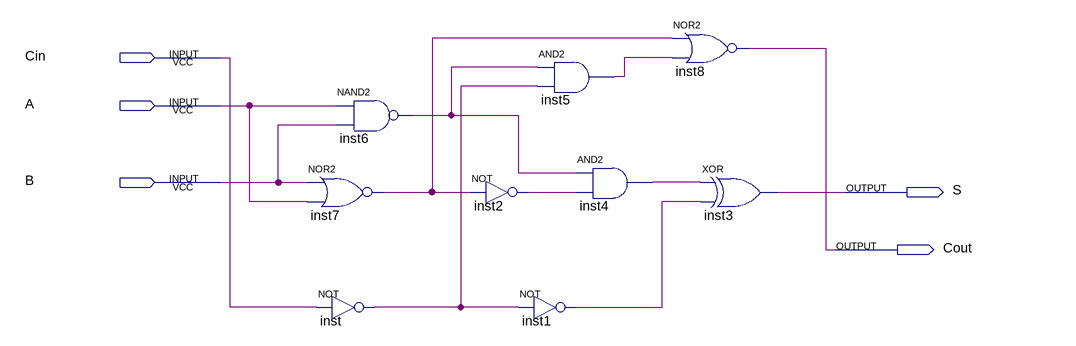
[diagram p0: schematic sheet]
// Quartus schematic soma1bit.bdf as structural Verilog: 9 symbols, 5 pins
module soma1bit (
  input  Cin,
  input  A,
  input  B,
  output S,
  output Cout
);

  wire inst1_out, inst2_out, inst4_out, inst5_out, inst6_out, inst7_out, inst_out;

  nand inst6 (inst6_out, A, B);
  nor inst7 (inst7_out, B, A);
  not inst (inst_out, Cin);
  not inst2 (inst2_out, inst7_out);
  and inst5 (inst5_out, inst6_out, inst_out);
  and inst4 (inst4_out, inst6_out, inst2_out);
  not inst1 (inst1_out, inst_out);
  nor inst8 (Cout, inst7_out, inst5_out);
  xor inst3 (S, inst4_out, inst1_out);
endmodule
